# EAGLE schematic power_board (EAGLE 6.4)
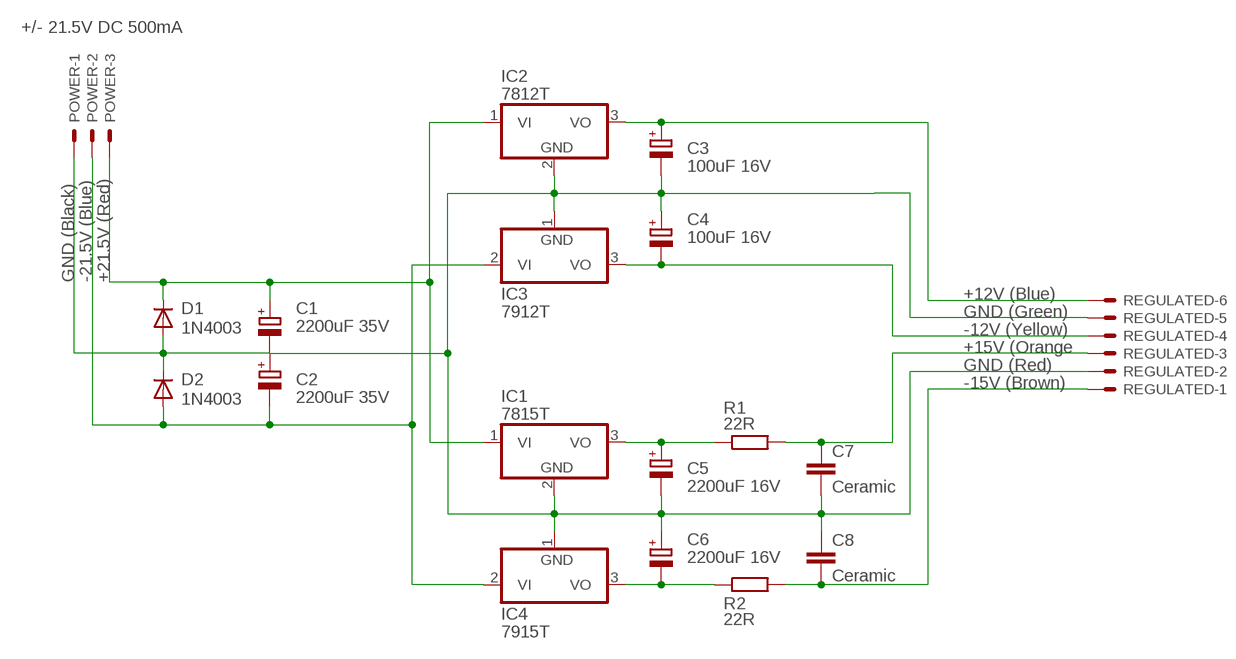
[diagram p0: schematic, sheet 1]

## Parts
C1  2200uF 35V  CPOL-EUE2.5-5  [E2,5-5]
C2  2200uF 35V  CPOL-EUE2.5-5  [E2,5-5]
C3  100uF 16V  CPOL-EUE2.5-5  [E2,5-5]
C4  100uF 16V  CPOL-EUE2.5-5  [E2,5-5]
C5  2200uF 16V  CPOL-EUE2.5-5  [E2,5-5]
C6  2200uF 16V  CPOL-EUE2.5-5  [E2,5-5]
C7  Ceramic  C-EU025-030X050  [C025-030X050]
C8  Ceramic  C-EU025-030X050  [C025-030X050]
D1  1N4003  DIODE-D-7.5  [D-7.5]
D2  1N4003  DIODE-D-7.5  [D-7.5]
IC1  7815T  [TO220H]
IC2  7812T  [TO220H]
IC3  7912T  7912L  [TO92]
IC4  7915T  [TO220H]
POWER  22-23-2031  [22-23-2031]
R1  22R  R-EU_0204/5  [0204/5]
R2  22R  R-EU_0204/5  [0204/5]
REGULATED  22-23-2061  [22-23-2061]

## Nets
N$1: C1.- C2.+ C3.- C4.+ D1.A D2.C IC2.2(GND) IC3.1(GND) POWER.1
N$2: C2.- D2.A IC3.2(VI) IC4.2(VI) POWER.2
N$3: C1.+ D1.C IC1.1(VI) IC2.1(VI) POWER.3
N$4: C3.+ IC2.3(VO) REGULATED.6
N$5: C4.- IC3.3(VO) REGULATED.4
N$6: C5.- C6.+ C7.2 C8.1 IC1.2(GND) IC4.1(GND) REGULATED.2
N$8: REGULATED.5
N$10: C5.+ IC1.3(VO) R1.1
N$11: C7.1 R1.2 REGULATED.3
N$12: C8.2 R2.2 REGULATED.1
N$13: C6.- IC4.3(VO) R2.1

## Notes on the sheet
- +/- 21.5V DC 500mA
- GND (Black) | -21.5V (Blue) | +21.5V (Red)
- +12V (Blue)
- GND (Green)
- -12V (Yellow)
- +15V (Orange
- GND (Red)
- -15V (Brown)

## Library data of the parts
C1-C6 = resistor:CPOL-EU: POLARIZED CAPACITOR, European symbol
C7 C8 = resistor:C-EU: CAPACITOR, European symbol
D1 D2 = diode:DIODE-: DIODE
IC1 IC2 = joakim:78*: Positive VOLTAGE REGULATOR Source: http://cache.national.com/ds/LM/LM78L05.pdf http://www.fairchildsemi.com/ds/LM/LM7805.pdf
IC3 IC4 = linear:79*: Negative VOLTAGE REGULATOR
POWER = con-molex:22-23-2031: .100" (2.54mm) Center Header - 3 Pin
R1 R2 = resistor:R-EU_: RESISTOR, European symbol
REGULATED = con-molex:22-23-2061: .100" (2.54mm) Center Header - 6 Pin